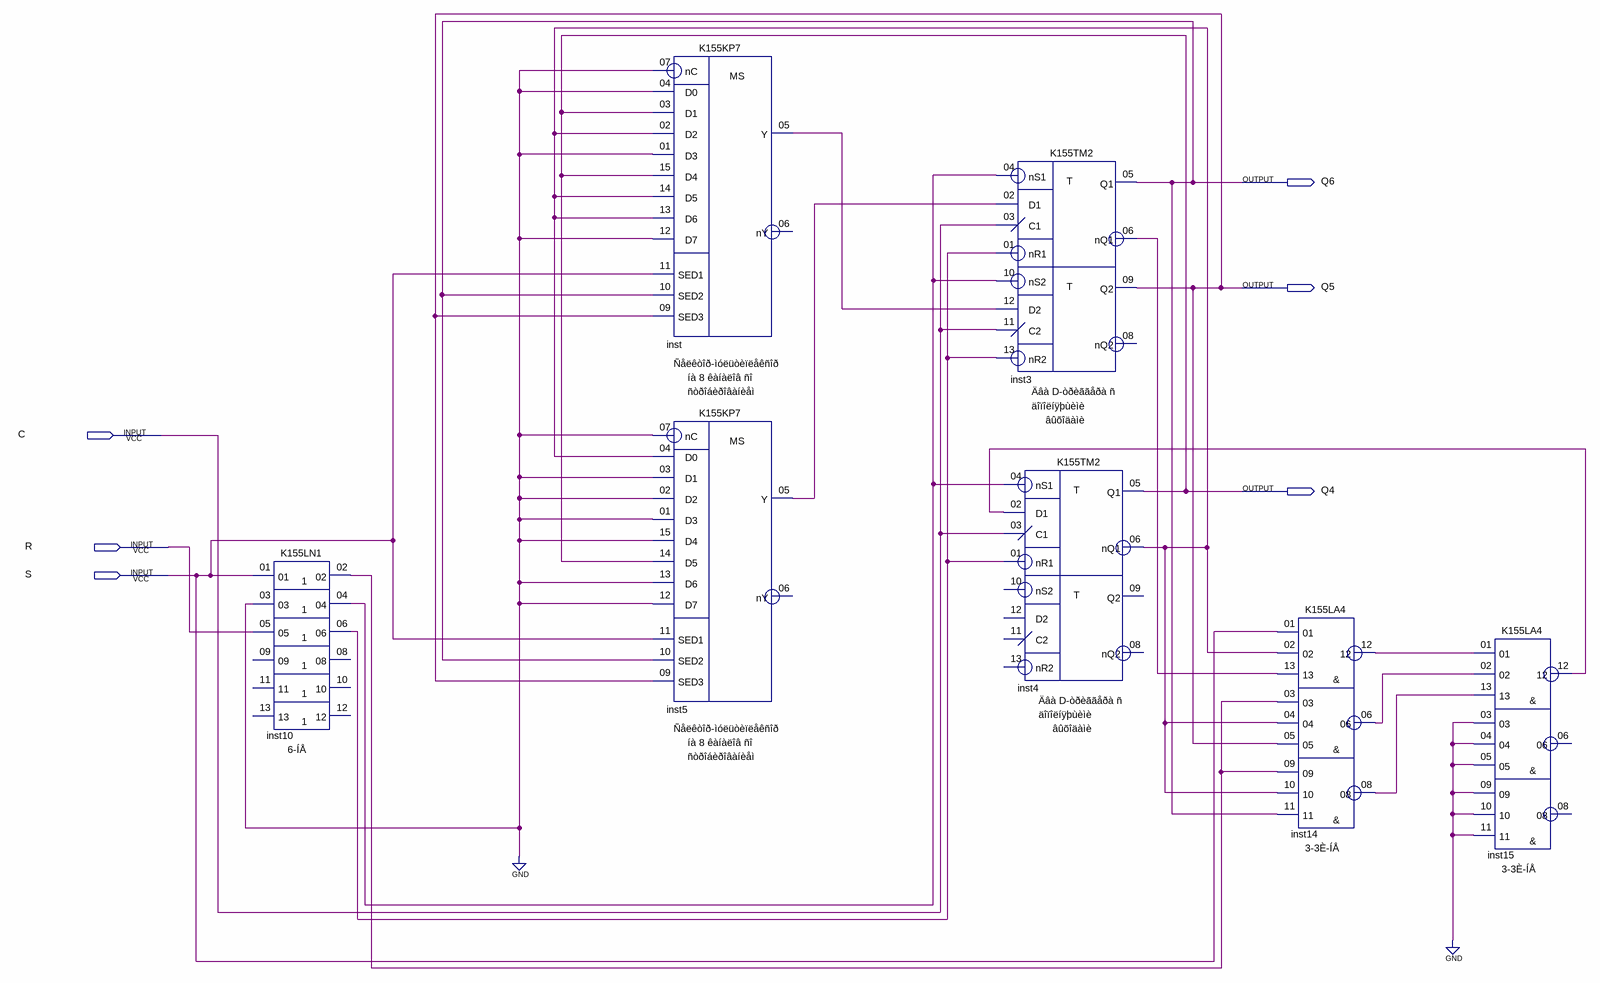
[diagram p0: schematic sheet]
// Quartus schematic lab12.bdf as structural Verilog: 7 symbols, 6 pins
module lab12 (
  input  C,
  input  R,
  input  S,
  output Q6,
  output Q5,
  output Q4
);

  wire inst3_nq1, inst4_nq1, inst5_y, inst10_02, inst10_04, inst10_06, inst14_06, inst14_08, inst14_12,
       inst15_12, inst_y;

  K155LN1 inst10 (
    .\01 (S), .\03 (1'b0), .\05 (R), .\02 (inst10_02), .\04 (inst10_04), .\06 (inst10_06));  // open: 09, 11, 13, 08, 10, 12
  K155KP7 inst (
    .nC(1'b0), .D0(1'b0), .D1(Q4), .D2(inst4_nq1), .D3(1'b0), .D4(Q4), .D5(inst4_nq1), .D6(inst4_nq1),
    .D7(1'b0), .SED1(S), .SED2(Q6), .SED3(Q5), .Y(inst_y));  // open: nY
  K155KP7 inst5 (
    .nC(1'b0), .D0(inst4_nq1), .D1(1'b0), .D2(1'b0), .D3(1'b0), .D4(1'b0), .D5(Q4), .D6(1'b0), .D7(1'b0),
    .SED1(S), .SED2(Q6), .SED3(Q5), .Y(inst5_y));  // open: nY
  K155TM2 inst3 (
    .nS1(inst10_04), .nR1(inst10_06), .C1(C), .D1(inst5_y), .nS2(inst10_04), .nR2(inst10_06), .C2(C),
    .D2(inst_y), .Q1(Q6), .nQ1(inst3_nq1), .Q2(Q5));  // open: nQ2
  K155TM2 inst4 (
    .nS1(inst10_04), .nR1(inst10_06), .C1(C), .D1(inst15_12), .Q1(Q4), .nQ1(inst4_nq1));  // open: nS2, nR2, C2, D2, Q2, nQ2
  K155LA4 inst14 (
    .\01 (S), .\02 (inst4_nq1), .\13 (inst3_nq1), .\03 (inst10_02), .\04 (inst4_nq1), .\05 (Q5),
    .\09 (inst10_02), .\10 (inst4_nq1), .\11 (Q6), .\12 (inst14_12), .\06 (inst14_06), .\08 (inst14_08));
  K155LA4 inst15 (
    .\01 (inst14_12), .\02 (inst14_06), .\13 (inst14_08), .\03 (1'b0), .\04 (1'b0), .\05 (1'b0), .\09 (1'b0),
    .\10 (1'b0), .\11 (1'b0), .\12 (inst15_12));  // open: 06, 08
endmodule
